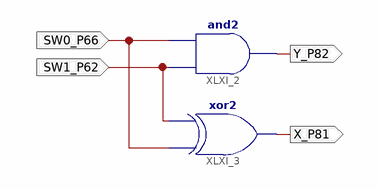
[diagram p0: schematic sheet 1]
// Xilinx ISE schematic Alps.sch (spartan6) as structural Verilog: 2 symbols, 4 ports
module Alps (
  input  SW1_P62,
  input  SW0_P66,
  output Y_P82,
  output X_P81
);

  and XLXI_2 (Y_P82, SW1_P62, SW0_P66);
  xor XLXI_3 (X_P81, SW0_P66, SW1_P62);
endmodule
